# Altium schematic sheet Sheet1.SchDoc
size A
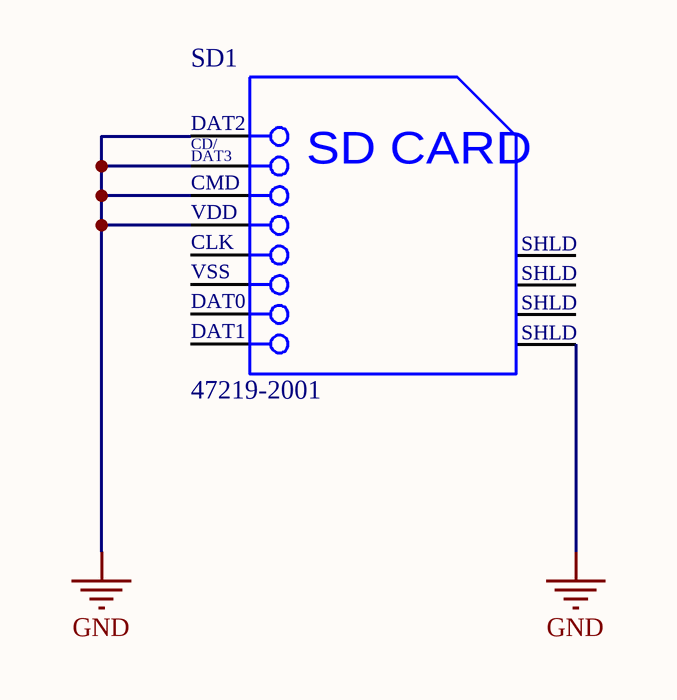
[diagram p0: Sheet1.SchDoc]

## Parts
SD1  47219-2001  [MOLX-47219-2001-8_V]

## Nets
GND: SD1.1(DAT2) SD1.2(CD/DAT3) SD1.3(CMD) SD1.4(VDD) SD1.12(SHLD)

Not connected (* = marked no-connect by the designer): SD1 5(CLK) 6(VSS) 7(DAT0) 8(DAT1) 9(SHLD) 10(SHLD) 11(SHLD)

## Notes on the sheet
- (in symbol CMP-2000-05245-1) CD/; DAT3; SD CARD

## Library data of the parts
SD1 = CMP-2000-05245-1: MicroSD Card Connector, Hinge Type, -40 to 85 degC, 8-Pin SMD, RoHS, Tape and Reel; Manufacturer: Molex; Current Rating: 500mA; Number of Contacts: 8; Pitch: 1.09mm; Insertion - Extraction Style: Hinged; Voltage Rating: 100VDC; Product: CardConnectors; Contact Material: CopperAlloy; Series: 47219; Packaging: Reel; Brand: Molex; Product Category: MemoryCardConnectors; Housing Material: Thermoplastic; Mounting Style: SMD/SMT; Termination Style: SMD; Datasheet Version: Rev. F, 06/2009; Card Type: microSD; Manufacturer URL: http://www.molex.com/; RoHS: Details; Datasheet URL: http://www.molex.com/pdm_docs/sd/472192001_sd.pdf; Factory Pack Quantity: 2400